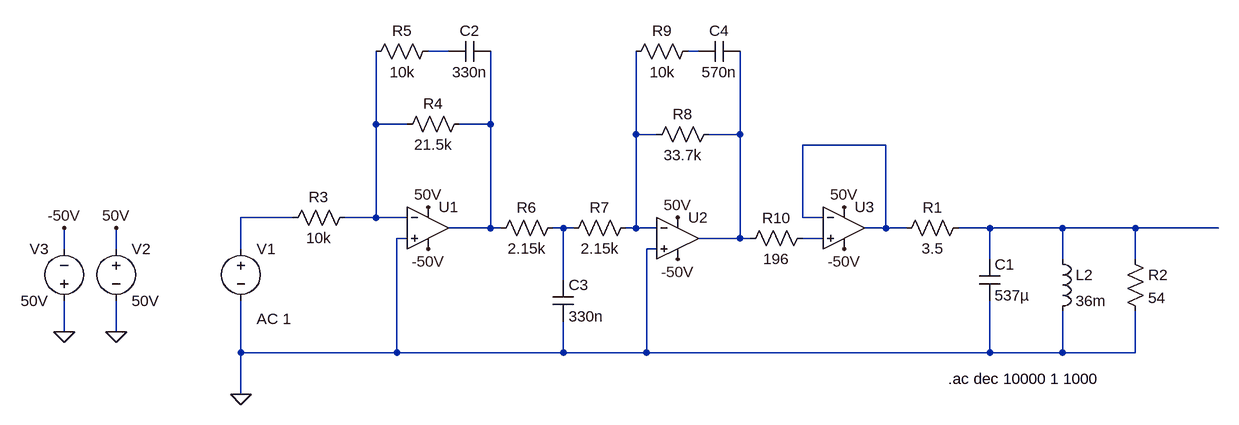
[diagram p0: schematic Linkwitz THOR with Transform.asc]
Linkwitz THOR with Transform.asc, the LTspice schematic file:
Version 4
SHEET 1 880 680
WIRE -496 -352 -528 -352
WIRE -112 -352 -128 -352
WIRE -608 -240 -608 -352
WIRE -560 -240 -608 -240
WIRE -432 -240 -432 -352
WIRE -432 -240 -480 -240
WIRE -208 -224 -208 -352
WIRE -176 -224 -208 -224
WIRE -48 -224 -48 -352
WIRE -48 -224 -96 -224
WIRE 176 -208 48 -208
WIRE -736 -96 -816 -96
WIRE -608 -96 -608 -240
WIRE -608 -96 -656 -96
WIRE -560 -96 -608 -96
WIRE 48 -96 48 -208
WIRE 80 -96 48 -96
WIRE -432 -80 -432 -240
WIRE -432 -80 -496 -80
WIRE -416 -80 -432 -80
WIRE -320 -80 -336 -80
WIRE -304 -80 -320 -80
WIRE -208 -80 -208 -224
WIRE -208 -80 -224 -80
WIRE -176 -80 -208 -80
WIRE 176 -80 176 -208
WIRE 176 -80 144 -80
WIRE 208 -80 176 -80
WIRE 336 -80 288 -80
WIRE 448 -80 336 -80
WIRE 560 -80 448 -80
WIRE 688 -80 560 -80
WIRE -560 -64 -576 -64
WIRE -48 -64 -48 -224
WIRE -48 -64 -112 -64
WIRE -32 -64 -48 -64
WIRE 80 -64 48 -64
WIRE -1088 -48 -1088 -80
WIRE -1008 -48 -1008 -80
WIRE -816 -48 -816 -96
WIRE -176 -48 -192 -48
WIRE 336 -32 336 -80
WIRE 448 -32 448 -80
WIRE 560 -32 560 -80
WIRE -320 0 -320 -80
WIRE -1088 80 -1088 32
WIRE -1008 80 -1008 32
WIRE -816 112 -816 32
WIRE -576 112 -576 -64
WIRE -576 112 -816 112
WIRE -320 112 -320 64
WIRE -320 112 -576 112
WIRE -192 112 -192 -48
WIRE -192 112 -320 112
WIRE 336 112 336 32
WIRE 336 112 -192 112
WIRE 448 112 448 48
WIRE 448 112 336 112
WIRE 560 112 560 48
WIRE 560 112 448 112
WIRE -816 176 -816 112
FLAG -816 176 0
FLAG -1008 -80 50V
FLAG -1008 80 0
FLAG -1088 80 0
FLAG -1088 -80 -50V
FLAG -528 -112 50V
FLAG -144 -96 50V
FLAG 112 -112 50V
FLAG -528 -48 -50V
FLAG -144 -32 -50V
FLAG 112 -48 -50V
SYMBOL voltage -816 -64 R0
WINDOW 123 24 124 Left 2
WINDOW 39 0 0 Left 0
SYMATTR Value2 AC 1
SYMATTR InstName V1
SYMATTR Value ""
SYMBOL res 304 -96 R90
WINDOW 0 0 56 VBottom 2
WINDOW 3 32 56 VTop 2
SYMATTR InstName R1
SYMATTR Value 3.5
SYMBOL cap 320 -32 R0
SYMATTR InstName C1
SYMATTR Value 537µ
SYMBOL ind 432 -48 R0
SYMATTR InstName L2
SYMATTR Value 36m
SYMBOL res 544 -48 R0
SYMATTR InstName R2
SYMATTR Value 54
SYMBOL res -640 -112 R90
WINDOW 0 0 56 VBottom 2
WINDOW 3 32 56 VTop 2
SYMATTR InstName R3
SYMATTR Value 10k
SYMBOL res -464 -256 R90
WINDOW 0 0 56 VBottom 2
WINDOW 3 32 56 VTop 2
SYMATTR InstName R4
SYMATTR Value 21.5k
SYMBOL cap -432 -368 R90
WINDOW 0 0 32 VBottom 2
WINDOW 3 32 32 VTop 2
SYMATTR InstName C2
SYMATTR Value 330n
SYMBOL res -512 -368 R90
WINDOW 0 0 56 VBottom 2
WINDOW 3 32 56 VTop 2
SYMATTR InstName R5
SYMATTR Value 10k
SYMBOL res -320 -96 R90
WINDOW 0 0 56 VBottom 2
WINDOW 3 32 56 VTop 2
SYMATTR InstName R6
SYMATTR Value 2.15k
SYMBOL res -208 -96 R90
WINDOW 0 0 56 VBottom 2
WINDOW 3 32 56 VTop 2
SYMATTR InstName R7
SYMATTR Value 2.15k
SYMBOL cap -336 0 R0
SYMATTR InstName C3
SYMATTR Value 330n
SYMBOL res -80 -240 R90
WINDOW 0 0 56 VBottom 2
WINDOW 3 32 56 VTop 2
SYMATTR InstName R8
SYMATTR Value 33.7k
SYMBOL res -112 -368 R90
WINDOW 0 0 56 VBottom 2
WINDOW 3 32 56 VTop 2
SYMATTR InstName R9
SYMATTR Value 10k
SYMBOL cap -48 -368 R90
WINDOW 0 0 32 VBottom 2
WINDOW 3 32 32 VTop 2
SYMATTR InstName C4
SYMATTR Value 570n
SYMBOL res 64 -80 R90
WINDOW 0 0 56 VBottom 2
WINDOW 3 32 56 VTop 2
SYMATTR InstName R10
SYMATTR Value 196
SYMBOL UniversalOpamp2 -528 -80 R0
SYMATTR InstName U1
SYMBOL UniversalOpamp2 -144 -64 R0
SYMATTR InstName U2
SYMBOL voltage -1008 -64 R0
SYMATTR InstName V2
SYMATTR Value 50V
SYMBOL Opamps/UniversalOpamp2 112 -80 R0
SYMATTR InstName U3
SYMBOL voltage -1088 48 R180
WINDOW 0 24 96 Left 2
WINDOW 3 24 16 Left 2
SYMATTR InstName V3
SYMATTR Value 50V
TEXT 272 152 Left 2 !.ac dec 10000 1 1000

The netlist it stands for:
* Linkwitz THOR with Transform.asc
V1 N008 0 AC 1
R1 N010 N007 3.5
C1 N010 0 537µ
L2 N010 0 36m
R2 N010 0 54
R3 N003 N008 10k
R4 N004 N003 21.5k
C2 N004 N001 330n
R5 N001 N003 10k
R6 N009 N004 2.15k
R7 N005 N009 2.15k
C3 N009 0 330n
R8 N006 N005 33.7k
R9 N002 N005 10k
C4 N006 N002 570n
R10 N011 N006 196
XU1 0 N003 50V -50V N004 level.2 Avol=1Meg GBW=10Meg Slew=10Meg ilimit=25m rail=0 Vos=0 phimargin=45 en=0 enk=0 in=0 ink=0 Rin=500Meg  ; pins IN+ IN- V+ V- OUT
XU2 0 N005 50V -50V N006 level.2 Avol=1Meg GBW=10Meg Slew=10Meg ilimit=25m rail=0 Vos=0 phimargin=45 en=0 enk=0 in=0 ink=0 Rin=500Meg  ; pins IN+ IN- V+ V- OUT
V2 50V 0 50V
XU3 N011 N007 50V -50V N007 level.2 Avol=1Meg GBW=10Meg Slew=10Meg ilimit=25m rail=0 Vos=0 phimargin=45 en=0 enk=0 in=0 ink=0 Rin=500Meg  ; pins IN+ IN- V+ V- OUT
V3 0 -50V 50V
.ac dec 10000 1 1000
.lib UniversalOpamps2.sub
.backanno
.end